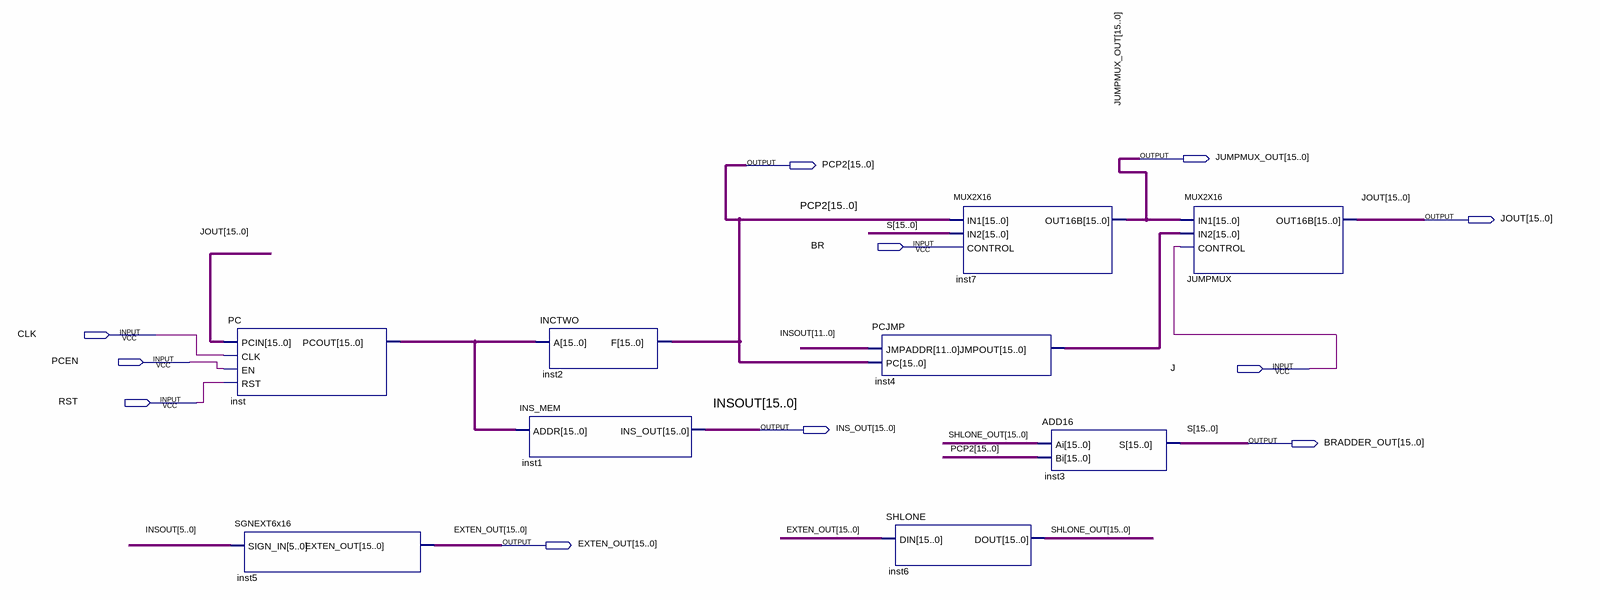
[diagram p0: schematic sheet]
// Quartus schematic m16dp1.bdf as structural Verilog: 9 symbols, 11 pins
module m16dp1 (
  input  BR,
  input  CLK,
  input  PCEN,
  input  J,
  input  RST,
  output [15:0] JUMPMUX_OUT,
  output [15:0] PCP2,
  output [15:0] JOUT,
  output [15:0] INS_OUT,
  output [15:0] BRADDER_OUT,
  output [15:0] EXTEN_OUT
);

  wire [15:0] inst4_jmpout, inst_pcout, SHLONE_OUT;

  PC inst (.PCIN(JOUT), .CLK(CLK), .EN(PCEN), .RST(RST), .PCOUT(inst_pcout));
  SGNEXT6x16 inst5 (.SIGN_IN(INS_OUT[5:0]), .EXTEN_OUT(EXTEN_OUT));
  INCTWO inst2 (.A(inst_pcout), .F(PCP2));
  INS_MEM inst1 (.ADDR(inst_pcout), .INS_OUT(INS_OUT));
  PCJMP inst4 (.JMPADDR(INS_OUT[11:0]), .PC(PCP2), .JMPOUT(inst4_jmpout));
  SHLONE inst6 (.DIN(EXTEN_OUT), .DOUT(SHLONE_OUT));
  MUX2X16 inst7 (.IN1(PCP2), .IN2(BRADDER_OUT), .CONTROL(BR), .OUT16B(JUMPMUX_OUT));
  ADD16 inst3 (.Ai(SHLONE_OUT), .Bi(PCP2), .S(BRADDER_OUT));
  MUX2X16 JUMPMUX (.IN1(JUMPMUX_OUT), .IN2(inst4_jmpout), .CONTROL(J), .OUT16B(JOUT));

  // Other names for the same wires on the sheet: INSOUT[15:0] = INS_OUT; S[15:0] = BRADDER_OUT
endmodule
